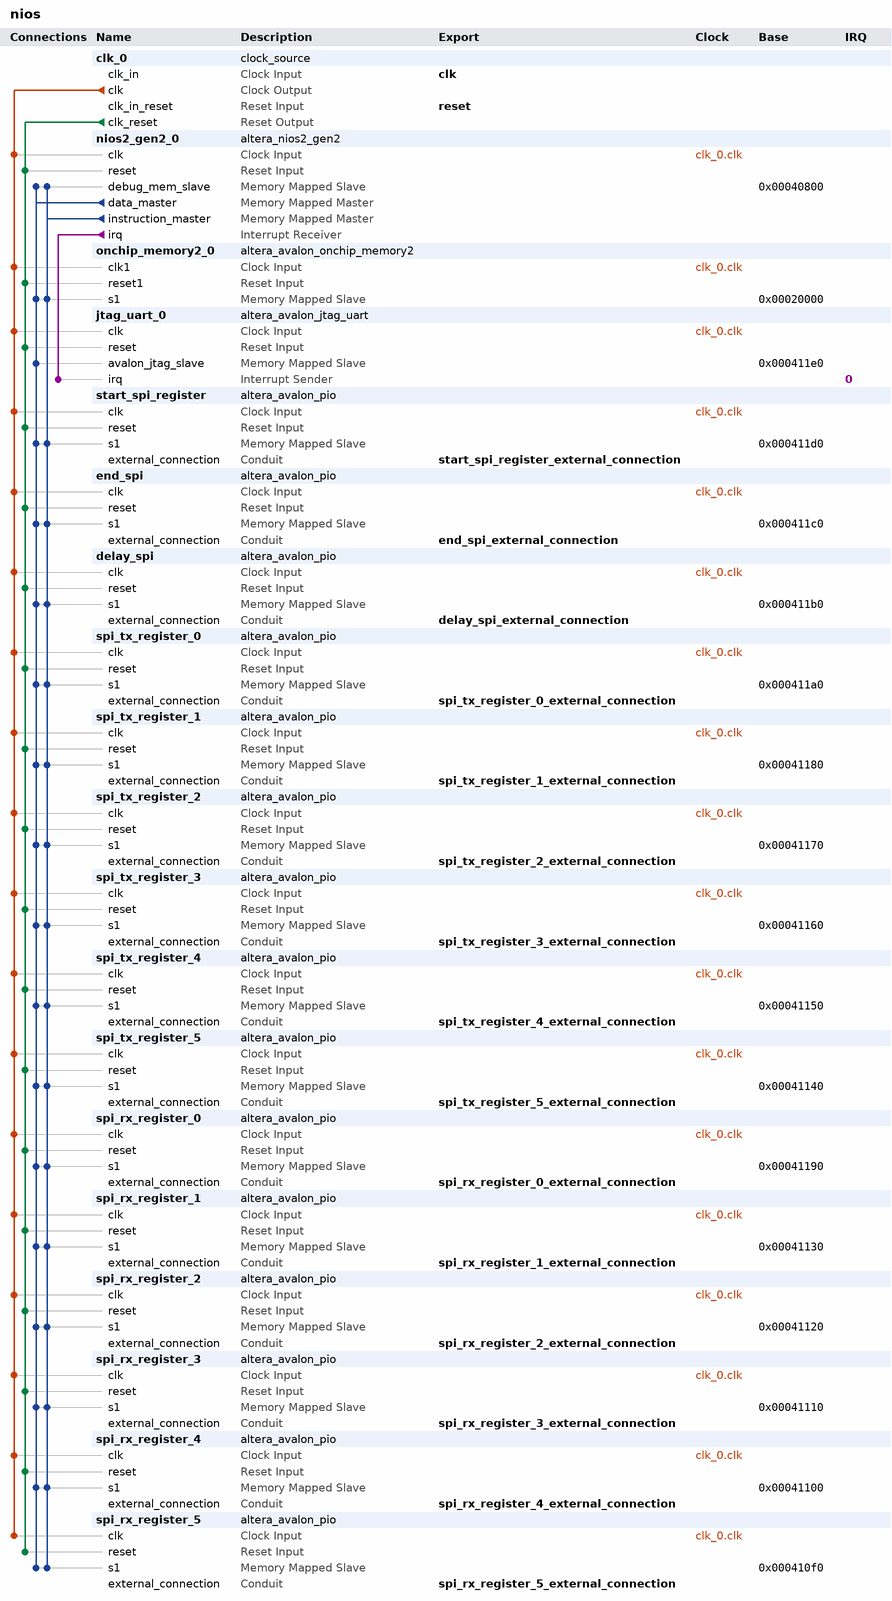
[diagram p0: system contents]
# Platform Designer (Qsys) system nios, Cyclone V 5CGXFC7C7F23C8
# Parameters at their usual value, and those the tool derives, are not listed.
package require -exact qsys 17.1
create_system nios
set_project_property DEVICE_FAMILY {Cyclone V}
set_project_property DEVICE 5CGXFC7C7F23C8

add_instance clk_0 clock_source 17.1
set_instance_parameter_value clk_0 clockFrequency 50000000

add_instance nios2_gen2_0 altera_nios2_gen2 17.1
set_instance_parameter_value nios2_gen2_0 dcache_size 2048
set_instance_parameter_value nios2_gen2_0 exceptionSlave onchip_memory2_0.s1
set_instance_parameter_value nios2_gen2_0 icache_size 4096
set_instance_parameter_value nios2_gen2_0 impl Tiny
set_instance_parameter_value nios2_gen2_0 resetSlave onchip_memory2_0.s1

add_instance onchip_memory2_0 altera_avalon_onchip_memory2 17.1
set_instance_parameter_value onchip_memory2_0 dataWidth 32
set_instance_parameter_value onchip_memory2_0 dualPort false
set_instance_parameter_value onchip_memory2_0 initMemContent true
set_instance_parameter_value onchip_memory2_0 initializationFileName onchip_mem.hex
set_instance_parameter_value onchip_memory2_0 memorySize 100000

add_instance jtag_uart_0 altera_avalon_jtag_uart 17.1
set_instance_parameter_value jtag_uart_0 simInteractiveOptions NO_INTERACTIVE_WINDOWS

add_instance start_spi_register altera_avalon_pio 17.1
set_instance_parameter_value start_spi_register direction Output
set_instance_parameter_value start_spi_register width 6

add_instance end_spi altera_avalon_pio 17.1
set_instance_parameter_value end_spi direction Input
set_instance_parameter_value end_spi width 1

add_instance delay_spi altera_avalon_pio 17.1
set_instance_parameter_value delay_spi direction Output
set_instance_parameter_value delay_spi width 8

add_instance spi_tx_register_0 altera_avalon_pio 17.1
set_instance_parameter_value spi_tx_register_0 direction Output
set_instance_parameter_value spi_tx_register_0 width 16

add_instance spi_tx_register_1 altera_avalon_pio 17.1
set_instance_parameter_value spi_tx_register_1 direction Output
set_instance_parameter_value spi_tx_register_1 width 16

add_instance spi_tx_register_2 altera_avalon_pio 17.1
set_instance_parameter_value spi_tx_register_2 direction Output
set_instance_parameter_value spi_tx_register_2 width 16

add_instance spi_tx_register_3 altera_avalon_pio 17.1
set_instance_parameter_value spi_tx_register_3 direction Output
set_instance_parameter_value spi_tx_register_3 width 16

add_instance spi_tx_register_4 altera_avalon_pio 17.1
set_instance_parameter_value spi_tx_register_4 direction Output
set_instance_parameter_value spi_tx_register_4 width 16

add_instance spi_tx_register_5 altera_avalon_pio 17.1
set_instance_parameter_value spi_tx_register_5 direction Output
set_instance_parameter_value spi_tx_register_5 width 16

add_instance spi_rx_register_0 altera_avalon_pio 17.1
set_instance_parameter_value spi_rx_register_0 direction Input
set_instance_parameter_value spi_rx_register_0 width 16

add_instance spi_rx_register_1 altera_avalon_pio 17.1
set_instance_parameter_value spi_rx_register_1 direction Input
set_instance_parameter_value spi_rx_register_1 width 16

add_instance spi_rx_register_2 altera_avalon_pio 17.1
set_instance_parameter_value spi_rx_register_2 direction Input
set_instance_parameter_value spi_rx_register_2 width 16

add_instance spi_rx_register_3 altera_avalon_pio 17.1
set_instance_parameter_value spi_rx_register_3 direction Input
set_instance_parameter_value spi_rx_register_3 width 16

add_instance spi_rx_register_4 altera_avalon_pio 17.1
set_instance_parameter_value spi_rx_register_4 direction Input
set_instance_parameter_value spi_rx_register_4 width 16

add_instance spi_rx_register_5 altera_avalon_pio 17.1
set_instance_parameter_value spi_rx_register_5 direction Input
set_instance_parameter_value spi_rx_register_5 width 16

# connections
add_connection clk_0.clk delay_spi.clk clock
add_connection clk_0.clk end_spi.clk clock
add_connection clk_0.clk jtag_uart_0.clk clock
add_connection clk_0.clk nios2_gen2_0.clk clock
add_connection clk_0.clk onchip_memory2_0.clk1 clock
add_connection clk_0.clk spi_rx_register_0.clk clock
add_connection clk_0.clk spi_rx_register_1.clk clock
add_connection clk_0.clk spi_rx_register_2.clk clock
add_connection clk_0.clk spi_rx_register_3.clk clock
add_connection clk_0.clk spi_rx_register_4.clk clock
add_connection clk_0.clk spi_rx_register_5.clk clock
add_connection clk_0.clk spi_tx_register_0.clk clock
add_connection clk_0.clk spi_tx_register_1.clk clock
add_connection clk_0.clk spi_tx_register_2.clk clock
add_connection clk_0.clk spi_tx_register_3.clk clock
add_connection clk_0.clk spi_tx_register_4.clk clock
add_connection clk_0.clk spi_tx_register_5.clk clock
add_connection clk_0.clk start_spi_register.clk clock
add_connection clk_0.clk_reset delay_spi.reset reset
add_connection clk_0.clk_reset end_spi.reset reset
add_connection clk_0.clk_reset jtag_uart_0.reset reset
add_connection clk_0.clk_reset nios2_gen2_0.reset reset
add_connection clk_0.clk_reset onchip_memory2_0.reset1 reset
add_connection clk_0.clk_reset spi_rx_register_0.reset reset
add_connection clk_0.clk_reset spi_rx_register_1.reset reset
add_connection clk_0.clk_reset spi_rx_register_2.reset reset
add_connection clk_0.clk_reset spi_rx_register_3.reset reset
add_connection clk_0.clk_reset spi_rx_register_4.reset reset
add_connection clk_0.clk_reset spi_rx_register_5.reset reset
add_connection clk_0.clk_reset spi_tx_register_0.reset reset
add_connection clk_0.clk_reset spi_tx_register_1.reset reset
add_connection clk_0.clk_reset spi_tx_register_2.reset reset
add_connection clk_0.clk_reset spi_tx_register_3.reset reset
add_connection clk_0.clk_reset spi_tx_register_4.reset reset
add_connection clk_0.clk_reset spi_tx_register_5.reset reset
add_connection clk_0.clk_reset start_spi_register.reset reset
add_connection nios2_gen2_0.data_master delay_spi.s1 avalon
set_connection_parameter_value nios2_gen2_0.data_master/delay_spi.s1 baseAddress 0x000411b0
add_connection nios2_gen2_0.data_master end_spi.s1 avalon
set_connection_parameter_value nios2_gen2_0.data_master/end_spi.s1 baseAddress 0x000411c0
add_connection nios2_gen2_0.data_master jtag_uart_0.avalon_jtag_slave avalon
set_connection_parameter_value nios2_gen2_0.data_master/jtag_uart_0.avalon_jtag_slave baseAddress 0x000411e0
add_connection nios2_gen2_0.data_master nios2_gen2_0.debug_mem_slave avalon
set_connection_parameter_value nios2_gen2_0.data_master/nios2_gen2_0.debug_mem_slave baseAddress 0x00040800
add_connection nios2_gen2_0.data_master onchip_memory2_0.s1 avalon
set_connection_parameter_value nios2_gen2_0.data_master/onchip_memory2_0.s1 baseAddress 0x00020000
add_connection nios2_gen2_0.data_master spi_rx_register_0.s1 avalon
set_connection_parameter_value nios2_gen2_0.data_master/spi_rx_register_0.s1 baseAddress 0x00041190
add_connection nios2_gen2_0.data_master spi_rx_register_1.s1 avalon
set_connection_parameter_value nios2_gen2_0.data_master/spi_rx_register_1.s1 baseAddress 0x00041130
add_connection nios2_gen2_0.data_master spi_rx_register_2.s1 avalon
set_connection_parameter_value nios2_gen2_0.data_master/spi_rx_register_2.s1 baseAddress 0x00041120
add_connection nios2_gen2_0.data_master spi_rx_register_3.s1 avalon
set_connection_parameter_value nios2_gen2_0.data_master/spi_rx_register_3.s1 baseAddress 0x00041110
add_connection nios2_gen2_0.data_master spi_rx_register_4.s1 avalon
set_connection_parameter_value nios2_gen2_0.data_master/spi_rx_register_4.s1 baseAddress 0x00041100
add_connection nios2_gen2_0.data_master spi_rx_register_5.s1 avalon
set_connection_parameter_value nios2_gen2_0.data_master/spi_rx_register_5.s1 baseAddress 0x000410f0
add_connection nios2_gen2_0.data_master spi_tx_register_0.s1 avalon
set_connection_parameter_value nios2_gen2_0.data_master/spi_tx_register_0.s1 baseAddress 0x000411a0
add_connection nios2_gen2_0.data_master spi_tx_register_1.s1 avalon
set_connection_parameter_value nios2_gen2_0.data_master/spi_tx_register_1.s1 baseAddress 0x00041180
add_connection nios2_gen2_0.data_master spi_tx_register_2.s1 avalon
set_connection_parameter_value nios2_gen2_0.data_master/spi_tx_register_2.s1 baseAddress 0x00041170
add_connection nios2_gen2_0.data_master spi_tx_register_3.s1 avalon
set_connection_parameter_value nios2_gen2_0.data_master/spi_tx_register_3.s1 baseAddress 0x00041160
add_connection nios2_gen2_0.data_master spi_tx_register_4.s1 avalon
set_connection_parameter_value nios2_gen2_0.data_master/spi_tx_register_4.s1 baseAddress 0x00041150
add_connection nios2_gen2_0.data_master spi_tx_register_5.s1 avalon
set_connection_parameter_value nios2_gen2_0.data_master/spi_tx_register_5.s1 baseAddress 0x00041140
add_connection nios2_gen2_0.data_master start_spi_register.s1 avalon
set_connection_parameter_value nios2_gen2_0.data_master/start_spi_register.s1 baseAddress 0x000411d0
add_connection nios2_gen2_0.instruction_master delay_spi.s1 avalon
set_connection_parameter_value nios2_gen2_0.instruction_master/delay_spi.s1 baseAddress 0x000411b0
add_connection nios2_gen2_0.instruction_master end_spi.s1 avalon
set_connection_parameter_value nios2_gen2_0.instruction_master/end_spi.s1 baseAddress 0x000411c0
add_connection nios2_gen2_0.instruction_master nios2_gen2_0.debug_mem_slave avalon
set_connection_parameter_value nios2_gen2_0.instruction_master/nios2_gen2_0.debug_mem_slave baseAddress 0x00040800
add_connection nios2_gen2_0.instruction_master onchip_memory2_0.s1 avalon
set_connection_parameter_value nios2_gen2_0.instruction_master/onchip_memory2_0.s1 baseAddress 0x00020000
add_connection nios2_gen2_0.instruction_master spi_rx_register_0.s1 avalon
set_connection_parameter_value nios2_gen2_0.instruction_master/spi_rx_register_0.s1 baseAddress 0x00041190
add_connection nios2_gen2_0.instruction_master spi_rx_register_1.s1 avalon
set_connection_parameter_value nios2_gen2_0.instruction_master/spi_rx_register_1.s1 baseAddress 0x00041130
add_connection nios2_gen2_0.instruction_master spi_rx_register_2.s1 avalon
set_connection_parameter_value nios2_gen2_0.instruction_master/spi_rx_register_2.s1 baseAddress 0x00041120
add_connection nios2_gen2_0.instruction_master spi_rx_register_3.s1 avalon
set_connection_parameter_value nios2_gen2_0.instruction_master/spi_rx_register_3.s1 baseAddress 0x00041110
add_connection nios2_gen2_0.instruction_master spi_rx_register_4.s1 avalon
set_connection_parameter_value nios2_gen2_0.instruction_master/spi_rx_register_4.s1 baseAddress 0x00041100
add_connection nios2_gen2_0.instruction_master spi_rx_register_5.s1 avalon
set_connection_parameter_value nios2_gen2_0.instruction_master/spi_rx_register_5.s1 baseAddress 0x000410f0
add_connection nios2_gen2_0.instruction_master spi_tx_register_0.s1 avalon
set_connection_parameter_value nios2_gen2_0.instruction_master/spi_tx_register_0.s1 baseAddress 0x000411a0
add_connection nios2_gen2_0.instruction_master spi_tx_register_1.s1 avalon
set_connection_parameter_value nios2_gen2_0.instruction_master/spi_tx_register_1.s1 baseAddress 0x00041180
add_connection nios2_gen2_0.instruction_master spi_tx_register_2.s1 avalon
set_connection_parameter_value nios2_gen2_0.instruction_master/spi_tx_register_2.s1 baseAddress 0x00041170
add_connection nios2_gen2_0.instruction_master spi_tx_register_3.s1 avalon
set_connection_parameter_value nios2_gen2_0.instruction_master/spi_tx_register_3.s1 baseAddress 0x00041160
add_connection nios2_gen2_0.instruction_master spi_tx_register_4.s1 avalon
set_connection_parameter_value nios2_gen2_0.instruction_master/spi_tx_register_4.s1 baseAddress 0x00041150
add_connection nios2_gen2_0.instruction_master spi_tx_register_5.s1 avalon
set_connection_parameter_value nios2_gen2_0.instruction_master/spi_tx_register_5.s1 baseAddress 0x00041140
add_connection nios2_gen2_0.instruction_master start_spi_register.s1 avalon
set_connection_parameter_value nios2_gen2_0.instruction_master/start_spi_register.s1 baseAddress 0x000411d0
add_connection nios2_gen2_0.irq jtag_uart_0.irq interrupt
set_connection_parameter_value nios2_gen2_0.irq/jtag_uart_0.irq irqNumber 0

# exported interfaces
add_interface clk clock sink
set_interface_property clk EXPORT_OF clk_0.clk_in
add_interface delay_spi_external_connection conduit end
set_interface_property delay_spi_external_connection EXPORT_OF delay_spi.external_connection
add_interface end_spi_external_connection conduit end
set_interface_property end_spi_external_connection EXPORT_OF end_spi.external_connection
add_interface reset reset sink
set_interface_property reset EXPORT_OF clk_0.clk_in_reset
add_interface spi_rx_register_0_external_connection conduit end
set_interface_property spi_rx_register_0_external_connection EXPORT_OF spi_rx_register_0.external_connection
add_interface spi_rx_register_1_external_connection conduit end
set_interface_property spi_rx_register_1_external_connection EXPORT_OF spi_rx_register_1.external_connection
add_interface spi_rx_register_2_external_connection conduit end
set_interface_property spi_rx_register_2_external_connection EXPORT_OF spi_rx_register_2.external_connection
add_interface spi_rx_register_3_external_connection conduit end
set_interface_property spi_rx_register_3_external_connection EXPORT_OF spi_rx_register_3.external_connection
add_interface spi_rx_register_4_external_connection conduit end
set_interface_property spi_rx_register_4_external_connection EXPORT_OF spi_rx_register_4.external_connection
add_interface spi_rx_register_5_external_connection conduit end
set_interface_property spi_rx_register_5_external_connection EXPORT_OF spi_rx_register_5.external_connection
add_interface spi_tx_register_0_external_connection conduit end
set_interface_property spi_tx_register_0_external_connection EXPORT_OF spi_tx_register_0.external_connection
add_interface spi_tx_register_1_external_connection conduit end
set_interface_property spi_tx_register_1_external_connection EXPORT_OF spi_tx_register_1.external_connection
add_interface spi_tx_register_2_external_connection conduit end
set_interface_property spi_tx_register_2_external_connection EXPORT_OF spi_tx_register_2.external_connection
add_interface spi_tx_register_3_external_connection conduit end
set_interface_property spi_tx_register_3_external_connection EXPORT_OF spi_tx_register_3.external_connection
add_interface spi_tx_register_4_external_connection conduit end
set_interface_property spi_tx_register_4_external_connection EXPORT_OF spi_tx_register_4.external_connection
add_interface spi_tx_register_5_external_connection conduit end
set_interface_property spi_tx_register_5_external_connection EXPORT_OF spi_tx_register_5.external_connection
add_interface start_spi_register_external_connection conduit end
set_interface_property start_spi_register_external_connection EXPORT_OF start_spi_register.external_connection

set_interconnect_requirement {$system} qsys_mm.clockCrossingAdapter HANDSHAKE
set_interconnect_requirement {$system} qsys_mm.enableEccProtection FALSE
set_interconnect_requirement {$system} qsys_mm.insertDefaultSlave FALSE
set_interconnect_requirement {$system} qsys_mm.maxAdditionalLatency 1

save_system nios.qsys
